# Altium schematic sheet clock_mux.SchDoc
size 594 x 420 mm; SheetNumber: 3; SheetTotal: 4
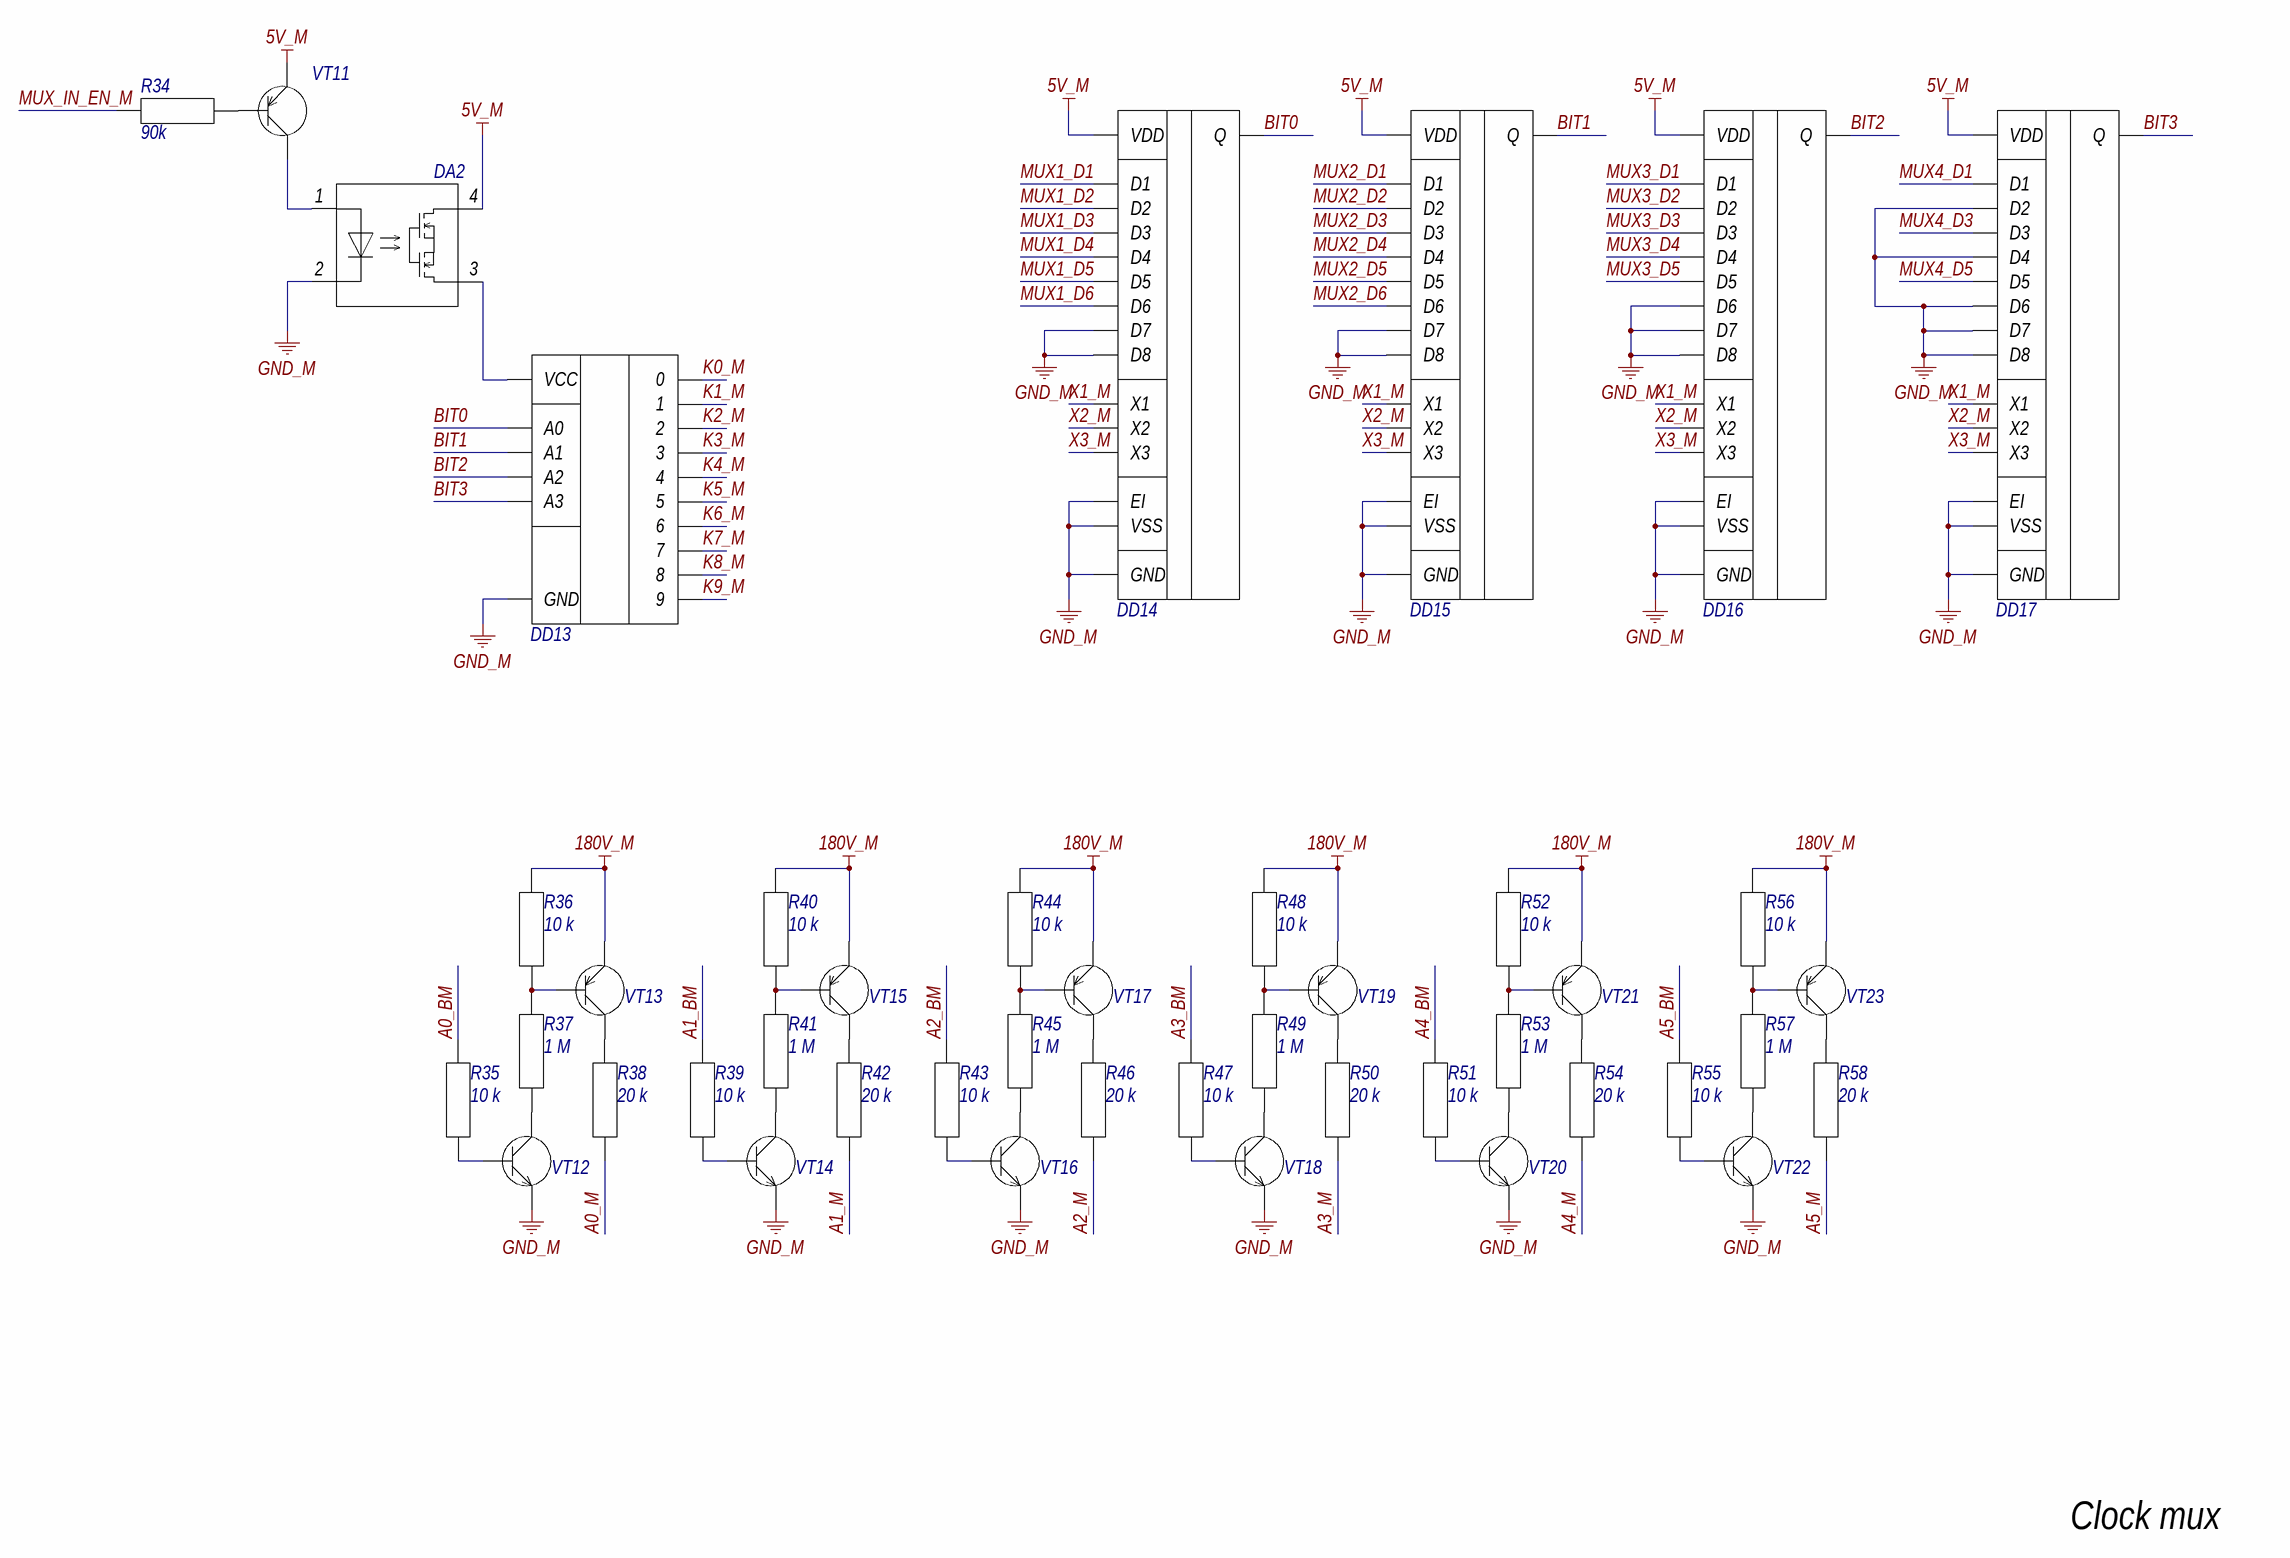
[diagram p0: clock_mux.SchDoc]

## Parts
DA2  CPC1008NTR  [CPC1008NTR]  (value not drawn)
DD13  К155ИД1  [DIP-16]  (value not drawn)
DD14  К561КП2  [DIP-16]  (value not drawn)
DD15  К561КП2  [DIP-16]  (value not drawn)
DD16  К561КП2  [DIP-16]  (value not drawn)
DD17  К561КП2  [DIP-16]  (value not drawn)
R34  value 90k  [RES-DIP]  (hidden comment: R)
R35  value 10 k  [RES-DIP-V]  (hidden comment: R)
R36  value 10 k  [RES-DIP-V]  (hidden comment: R)
R37  value 1 M  [RES-DIP-V]  (hidden comment: R)
R38  value 20 k  [RES-DIP-V]  (hidden comment: R)
R39  value 10 k  [RES-DIP-V]  (hidden comment: R)
R40  value 10 k  [RES-DIP-V]  (hidden comment: R)
R41  value 1 M  [RES-DIP-V]  (hidden comment: R)
R42  value 20 k  [RES-DIP-V]  (hidden comment: R)
R43  value 10 k  [RES-DIP-V]  (hidden comment: R)
R44  value 10 k  [RES-DIP-V]  (hidden comment: R)
R45  value 1 M  [RES-DIP-V]  (hidden comment: R)
R46  value 20 k  [RES-DIP-V]  (hidden comment: R)
R47  value 10 k  [RES-DIP-V]  (hidden comment: R)
R48  value 10 k  [RES-DIP-V]  (hidden comment: R)
R49  value 1 M  [RES-DIP-V]  (hidden comment: R)
R50  value 20 k  [RES-DIP-V]  (hidden comment: R)
R51  value 10 k  [RES-DIP-V]  (hidden comment: R)
R52  value 10 k  [RES-DIP-V]  (hidden comment: R)
R53  value 1 M  [RES-DIP-V]  (hidden comment: R)
R54  value 20 k  [RES-DIP-V]  (hidden comment: R)
R55  value 10 k  [RES-DIP-V]  (hidden comment: R)
R56  value 10 k  [RES-DIP-V]  (hidden comment: R)
R57  value 1 M  [RES-DIP-V]  (hidden comment: R)
R58  value 20 k  [RES-DIP-V]  (hidden comment: R)
VT11  BC327  [BC327]  (value not drawn)
VT12  2N5551  [2N5551]  (value not drawn)
VT13  2N5401  [2N5401]  (value not drawn)
VT14  2N5551  [2N5551]  (value not drawn)
VT15  2N5401  [2N5401]  (value not drawn)
VT16  2N5551  [2N5551]  (value not drawn)
VT17  2N5401  [2N5401]  (value not drawn)
VT18  2N5551  [2N5551]  (value not drawn)
VT19  2N5401  [2N5401]  (value not drawn)
VT20  2N5551  [2N5551]  (value not drawn)
VT21  2N5401  [2N5401]  (value not drawn)
VT22  2N5551  [2N5551]  (value not drawn)
VT23  2N5401  [2N5401]  (value not drawn)

## Nets
5V_M: DA2.4 DD14.16(VDD) DD15.16(VDD) DD16.16(VDD) DD17.16(VDD) VT11.3(E)
180V_M: R36.2 R40.2 R44.2 R48.2 R52.2 R56.2 VT13.1(E) VT15.1(E) VT17.1(E) VT19.1(E) VT21.1(E) VT23.1(E)
GND_M: DA2.2 DD13.12(GND) DD14.2(D7) DD14.4(D8) DD14.6(EI) DD14.7(VSS) DD14.8(GND) DD15.2(D7) DD15.4(D8) DD15.6(EI) DD15.7(VSS) DD15.8(GND) DD16.2(D7) DD16.4(D8) DD16.5(D6) DD16.6(EI) DD16.7(VSS) DD16.8(GND) DD17.2(D7) DD17.4(D8) DD17.5(D6) DD17.6(EI) DD17.7(VSS) DD17.8(GND) DD17.12(D4) DD17.14(D2) VT12.1(E) VT14.1(E) VT16.1(E) VT18.1(E) VT20.1(E) VT22.1(E)
A0_BM: R35.1
A0_M: R38.1
A1_BM: R39.1
A1_M: R42.1
A2_BM: R43.1
A2_M: R46.1
A3_BM: R47.1
A3_M: R50.1
A4_BM: R51.1
A4_M: R54.1
A5_BM: R55.1
A5_M: R58.1
BIT0: DD13.3(A0) DD14.3(Q)
BIT1: DD13.6(A1) DD15.3(Q)
BIT2: DD13.7(A2) DD16.3(Q)
BIT3: DD13.4(A3) DD17.3(Q)
K0_M: DD13.16(0)
K1_M: DD13.15(1)
K2_M: DD13.8(2)
K3_M: DD13.9(3)
K4_M: DD13.13(4)
K5_M: DD13.14(5)
K6_M: DD13.11(6)
K7_M: DD13.10(7)
K8_M: DD13.1(8)
K9_M: DD13.2(9)
MUX1_D1: DD14.13(D1)
MUX1_D2: DD14.14(D2)
MUX1_D3: DD14.15(D3)
MUX1_D4: DD14.12(D4)
MUX1_D5: DD14.1(D5)
MUX1_D6: DD14.5(D6)
MUX2_D1: DD15.13(D1)
MUX2_D2: DD15.14(D2)
MUX2_D3: DD15.15(D3)
MUX2_D4: DD15.12(D4)
MUX2_D5: DD15.1(D5)
MUX2_D6: DD15.5(D6)
MUX3_D1: DD16.13(D1)
MUX3_D2: DD16.14(D2)
MUX3_D3: DD16.15(D3)
MUX3_D4: DD16.12(D4)
MUX3_D5: DD16.1(D5)
MUX4_D1: DD17.13(D1)
MUX4_D3: DD17.15(D3)
MUX4_D5: DD17.1(D5)
MUX_IN_EN_M: R34.1
X1_M: DD14.11(X1) DD15.11(X1) DD16.11(X1) DD17.11(X1)
X2_M: DD14.10(X2) DD15.10(X2) DD16.10(X2) DD17.10(X2)
X3_M: DD14.9(X3) DD15.9(X3) DD16.9(X3) DD17.9(X3)
NetDA2_1: DA2.1 VT11.1(C)
NetDA2_3: DA2.3 DD13.5(VCC)
NetR34_2: R34.2 VT11.2(B)
NetR35_2: R35.2 VT12.2(B)
NetR36_1: R36.1 R37.2 VT13.2(B)
NetR37_1: R37.1 VT12.3(C)
NetR38_2: R38.2 VT13.3(C)
NetR39_2: R39.2 VT14.2(B)
NetR40_1: R40.1 R41.2 VT15.2(B)
NetR41_1: R41.1 VT14.3(C)
NetR42_2: R42.2 VT15.3(C)
NetR43_2: R43.2 VT16.2(B)
NetR44_1: R44.1 R45.2 VT17.2(B)
NetR45_1: R45.1 VT16.3(C)
NetR46_2: R46.2 VT17.3(C)
NetR47_2: R47.2 VT18.2(B)
NetR48_1: R48.1 R49.2 VT19.2(B)
NetR49_1: R49.1 VT18.3(C)
NetR50_2: R50.2 VT19.3(C)
NetR51_2: R51.2 VT20.2(B)
NetR52_1: R52.1 R53.2 VT21.2(B)
NetR53_1: R53.1 VT20.3(C)
NetR54_2: R54.2 VT21.3(C)
NetR55_2: R55.2 VT22.2(B)
NetR56_1: R56.1 R57.2 VT23.2(B)
NetR57_1: R57.1 VT22.3(C)
NetR58_2: R58.2 VT23.3(C)

## Notes on the sheet
- Clock mux
- Перв. застосув.
- Справ. №
- Підп. дата
- Інв. № дубл.
- Взам. інв. №
- Підп. та дата
- Зм.
- Розроб.
- Арк.
- № докум.
- Підп.
- Дата
- Літ.
- Маса
- Маштаб
- Перев.
- Аркушів
- Інв. № подл.
- Н.контр.
- Затв.
- КПІ ім. Ігоря Сікорського
- ALTIUM GOSTBOM2.0 KEV
- Копіював
- Формат А2

## Library data of the parts
DA2 = CPC1008NTR: Name: CPC1008NTR